# EAGLE design merkur-osdgruve-42-schield (EAGLE 6.6.0)
REVISION: 1.0
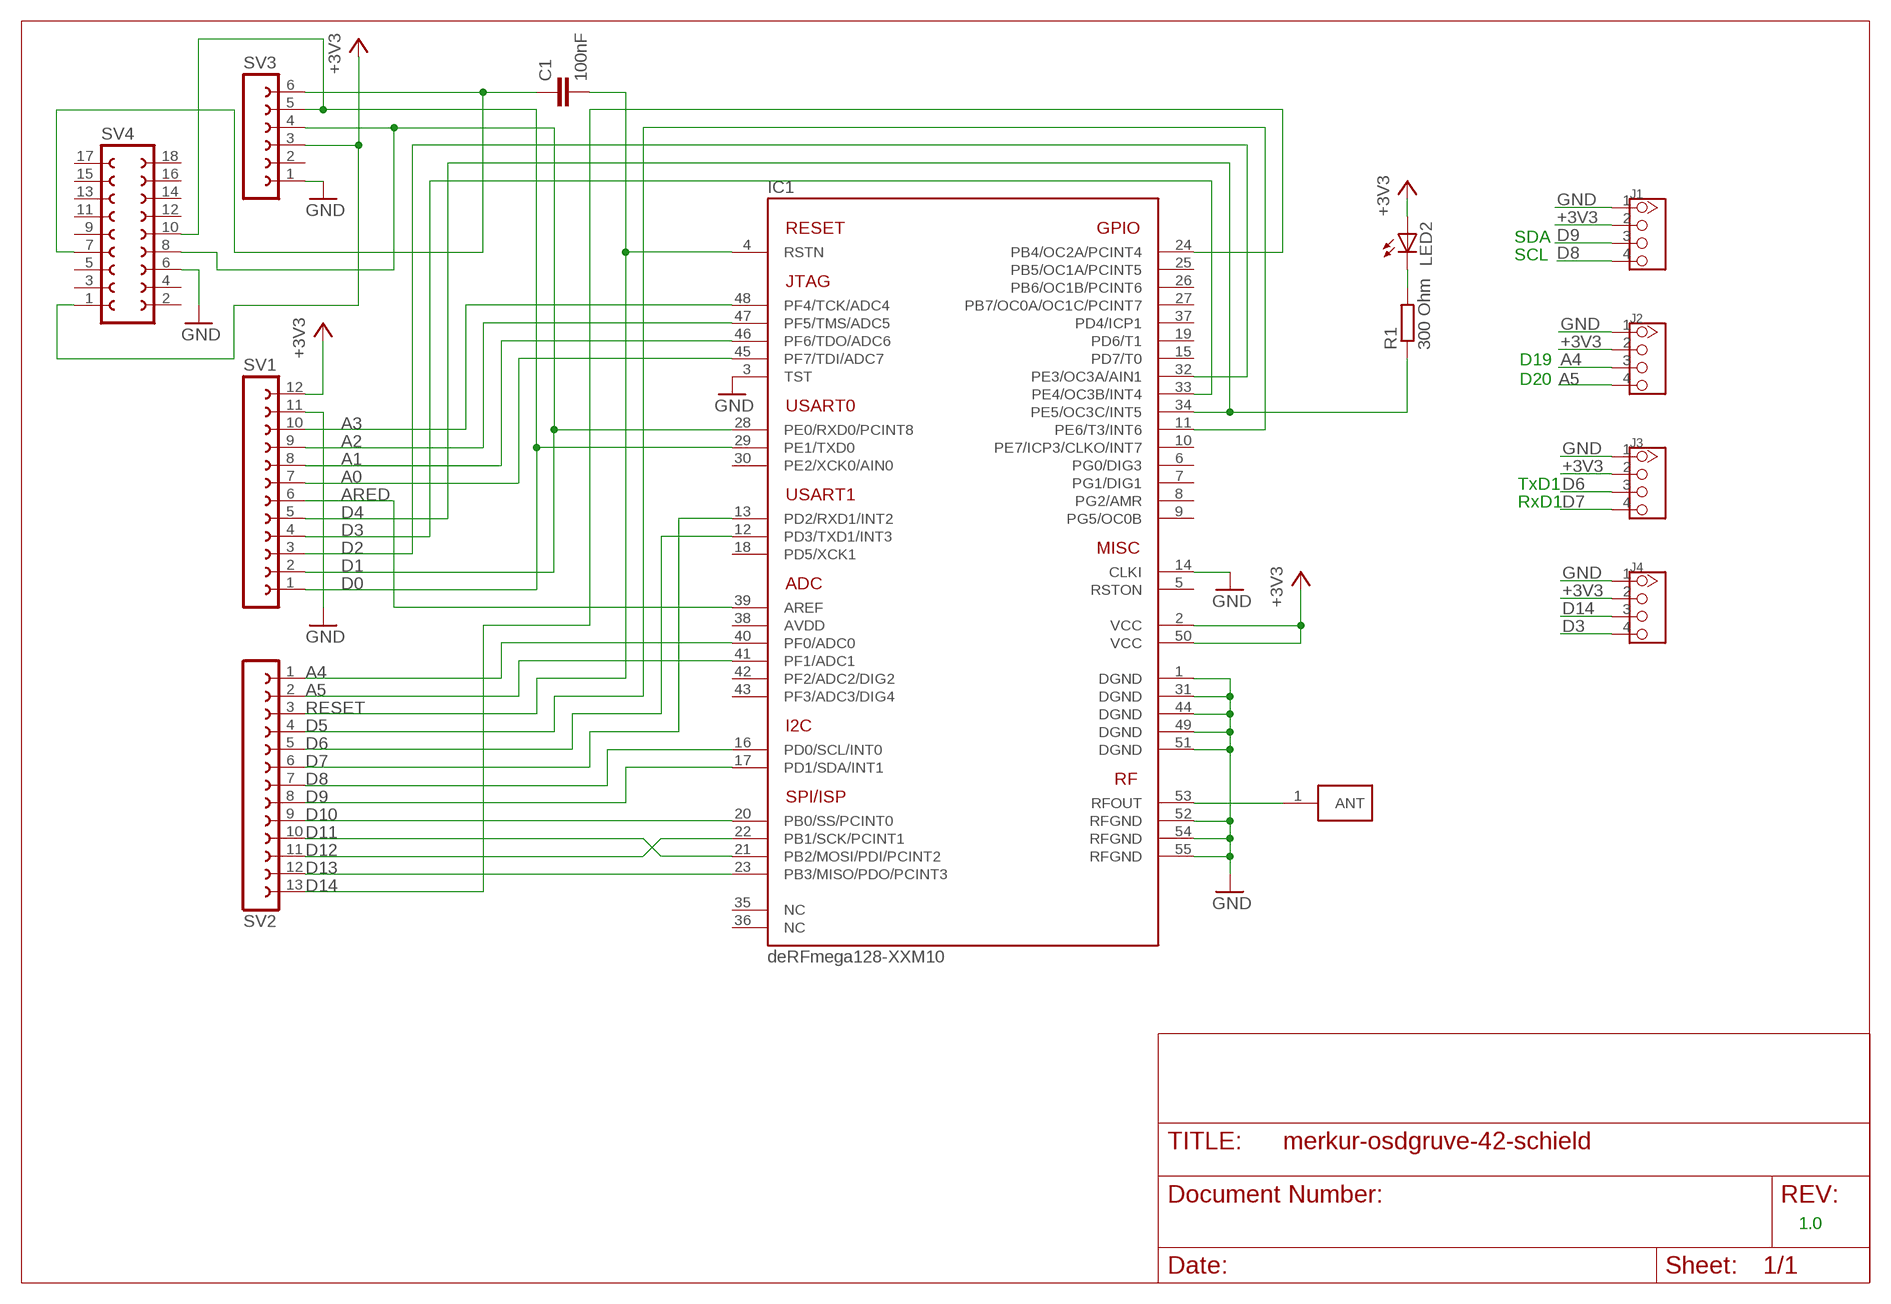
[diagram p0: schematic, sheet 1]

## Parts
C1  100nF  C-EUC0603  [C0603]
IC1  DERFMEGA128-XXM10  [A-M10]
J1  CONNECTOR_TWIG-4P-2.0-2.0  [CONNECTOR_4P-2.0]
J2  CONNECTOR_TWIG-4P-2.0-2.0  [CONNECTOR_4P-2.0]
J3  CONNECTOR_TWIG-4P-2.0-2.0  [CONNECTOR_4P-2.0]
J4  CONNECTOR_TWIG-4P-2.0-2.0  [CONNECTOR_4P-2.0]
LED2  LEDCHIP-LED0603  [CHIP-LED0603]
R1  300 Ohm  R-EU_R0603  [R0603]
SV1  FE12-1  [FE12]
SV2  FE13-1  [FE13]
SV3  FE06-1  [FE06]
SV4  FE09-2  [FE09-2]
U$1  PAD  [FE05-1]

## Nets
+3V3: IC1.2(VCC) IC1.50(VCC) J1.2 J2.2 J3.2 J4.2 LED2.A SV1.12 SV3.3 SV4.1
A0: IC1.45(PF7/TDI/ADC7) SV1.7
A1: IC1.46(PF6/TDO/ADC6) SV1.8
A2: IC1.47(PF5/TMS/ADC5) SV1.9
A3: IC1.48(PF4/TCK/ADC4) SV1.10
A4: IC1.40(PF0/ADC0) J2.3 SV2.1
A5: IC1.41(PF1/ADC1) J2.4 SV2.2
ARED: IC1.39(AREF) SV1.6
D0: IC1.29(PE1/TXD0) SV1.1 SV3.5 SV4.10
D1: IC1.28(PE0/RXD0/PCINT8) SV1.2 SV3.4 SV4.8
D2: IC1.32(PE3/OC3A/AIN1) SV1.3
D3: IC1.33(PE4/OC3B/INT4) J4.4 SV1.4
D4: IC1.34(PE5/OC3C/INT5) R1.1 SV1.5
D5: IC1.11(PE6/T3/INT6) SV2.4
D6: IC1.12(PD3/TXD1/INT3) J3.3 SV2.5
D7: IC1.13(PD2/RXD1/INT2) J3.4 SV2.6
D8: IC1.16(PD0/SCL/INT0) J1.4 SV2.7
D9: IC1.17(PD1/SDA/INT1) J1.3 SV2.8
D10: IC1.20(PB0/SS/PCINT0) SV2.9
D11: IC1.21(PB2/MOSI/PDI/PCINT2) SV2.10
D12: IC1.22(PB1/SCK/PCINT1) SV2.11
D13: IC1.23(PB3/MISO/PDO/PCINT3) SV2.12
D14: IC1.24(PB4/OC2A/PCINT4) J4.3 SV2.13
GND: IC1.1(DGND) IC1.3(TST) IC1.14(CLKI) IC1.31(DGND) IC1.44(DGND) IC1.49(DGND) IC1.51(DGND) IC1.52(RFGND) IC1.54(RFGND) IC1.55(RFGND) J1.1 J2.1 J3.1 J4.1 SV1.11 SV3.1 SV4.6
N$5: C1.1 SV3.6 SV4.7
N$23: LED2.C R1.2
RESET: C1.2 IC1.4(RSTN) SV2.3
RFOUT: IC1.53(RFOUT) U$1.1(ANT)
Unconnected: IC1.5(RSTON) IC1.6(PG0/DIG3) IC1.7(PG1/DIG1) IC1.8(PG2/AMR) IC1.9(PG5/OC0B) IC1.10(PE7/ICP3/CLKO/INT7) IC1.15(PD7/T0) IC1.18(PD5/XCK1) IC1.19(PD6/T1) IC1.25(PB5/OC1A/PCINT5) IC1.26(PB6/OC1B/PCINT6) IC1.27(PB7/OC0A/OC1C/PCINT7) IC1.30(PE2/XCK0/AIN0) IC1.35(NC) IC1.36(NC) IC1.37(PD4/ICP1) IC1.38(AVDD) IC1.42(PF2/ADC2/DIG2) IC1.43(PF3/ADC3/DIG4) SV3.2 SV4.2 SV4.3 SV4.4 SV4.5 SV4.9 SV4.11 SV4.12 SV4.13 SV4.14 SV4.15 SV4.16 SV4.17 SV4.18

## Notes on the sheet
- SDA
- SCL
- D19
- D20
- TxD1
- RxD1

## Library data of the parts
C1 = rcl:C-EU: CAPACITOR, European symbol
IC1 = deRFmodules:DERFMEGA128-XXM10: deRFmega128 IEEE 802.15.4 Low Power Wireless Radio Module Microcontroller: Atmel ATmega128RFA1 Transceiver: integrated Manufacturer: dresden elektronik ingenieurtechnik gmbh Website: http://www.dresden-elektronik.de
J1-J4 = Grove-Base Shield v1.3:CONNECTOR_TWIG-4P-2.0
LED2 = led:LED: LED OSRAM: - CHIPLED LG R971, LG N971, LY N971, LG Q971, LY Q971, LO R971, LY R971 LH N974, LH R974 LS Q976, LO Q976, LY Q976 LO Q996 - Hyper CHIPLED LW Q18S LB Q993, LB Q99A, LB R99A - SideLED LS A670, LO A670, LY A670, LG A670, LP A670 LB A673, LV A673, LT A673, LW A673 LH A674 LY A675 LS A676, LA A676, LO A676, LY A676, LW A676 LS A679, LY A679, LG A679 - Hyper Micro SIDELED® LS Y876, LA Y876, LO Y876, LY Y876 LT Y87S - SmartLED LW L88C, LW L88S LB L89C, LB L89S, LG L890 LS L89K, LO L89K, LY L89K LS L896, LA L896, LO L896, LY L896 - TOPLED LS T670, LO T670, LY T670, LG T670, LP T670 LSG T670, LSP T670, LSY T670, LOP T670, LYG T670 LG T671, LOG T671, LSG T671 LB T673, LV T673, LT T673, LW T673 LH T674 LS T676, LA T676, LO T676, LY T676, LB T676, LH T676, LSB T676, LW T676 LB T67C, LV T67C, LT T67C, LS T67K, LO T67K, LY T67K, LW E67C LS E67B, LA E67B, LO E67B, LY E67B, LB E67C, LV E67C, LT E67C LW T67C LS T679, LY T679, LG T679 LS T770, LO T770, LY T770, LG T770, LP T770 LB T773, LV T773, LT T773, LW T773 LH T774 LS E675, LA E675, LY E675, LS T675 LS T776, LA T776, LO T776, LY T776, LB T776 LHGB T686 LT T68C, LB T68C - Hyper Mini TOPLED® LB M676 - Mini TOPLED Santana® LG M470 LS M47K, LO M47K, LY M47K Source: http://www.osram.convergy.de LUXEON: - LUMILED® LXK2-PW12-R00, LXK2-PW12-S00, LXK2-PW14-U00, LXK2-PW14-V00 LXK2-PM12-R00, LXK2-PM12-S00, LXK2-PM14-U00 LXK2-PE12-Q00, LXK2-PE12-R00, LXK2-PE12-S00, LXK2-PE14-T00, LXK2-PE14-U00 LXK2-PB12-K00, LXK2-PB12-L00, LXK2-PB12-M00, LXK2-PB14-N00, LXK2-PB14-P00, LXK2-PB14-Q00 LXK2-PR12-L00, LXK2-PR12-M00, LXK2-PR14-Q00, LXK2-PR14-R00 LXK2-PD12-Q00, LXK2-PD12-R00, LXK2-PD12-S00 LXK2-PH12-R00, LXK2-PH12-S00 LXK2-PL12-P00, LXK2-PL12-Q00, LXK2-PL12-R00 Source: www.luxeon.com KINGBRIGHT: KA-3528ASYC Source: www.kingbright.com
R1 = rcl:R-EU_: RESISTOR, European symbol
SV1 = con-lsta:FE12-1: FEMALE HEADER; OC_FARNELL: unknown; OC_NEWARK: unknown
SV2 = con-lsta:FE13-1: FEMALE HEADER; OC_FARNELL: unknown; OC_NEWARK: unknown
SV3 = con-lsta:FE06-1: FEMALE HEADER; OC_FARNELL: unknown; OC_NEWARK: unknown
SV4 = con-lsta:FE09-2: FEMALE HEADER; OC_FARNELL: unknown; OC_NEWARK: unknown
U$1 = Pad:PAD

## Board
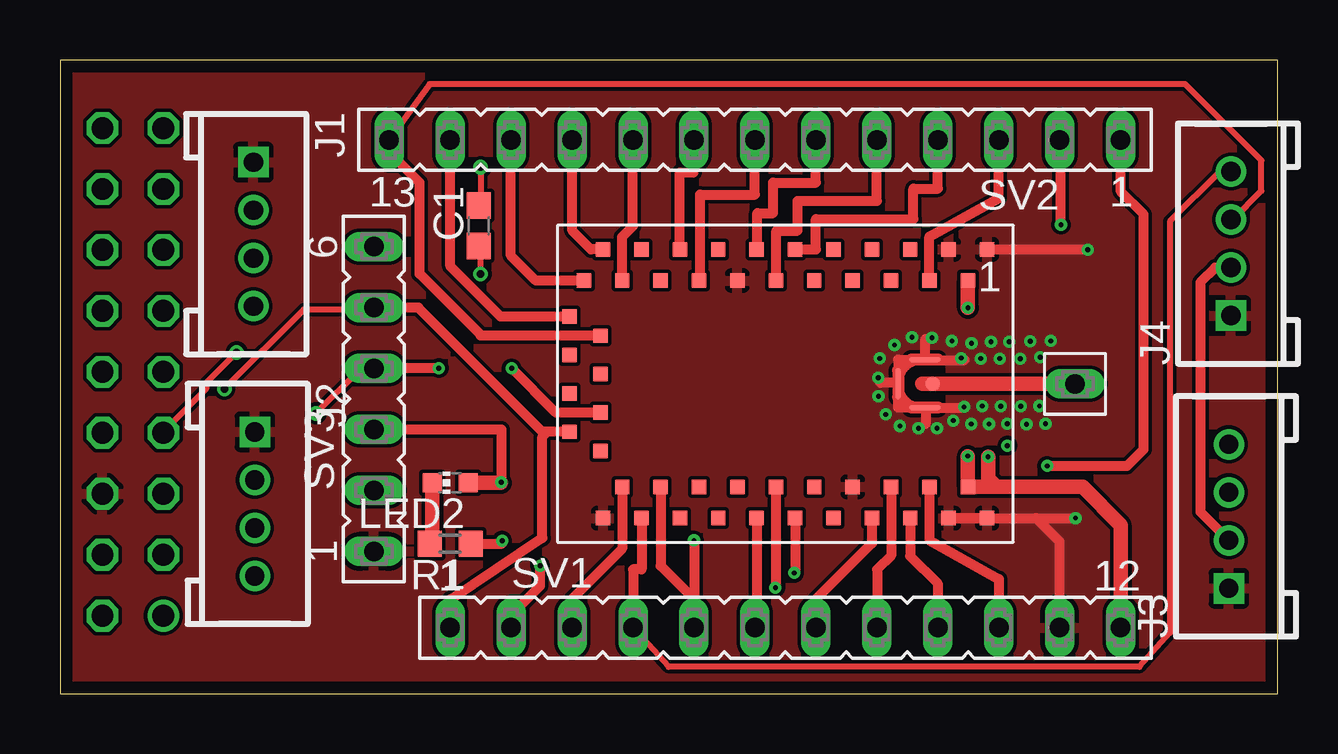
[diagram p1: board, top side]
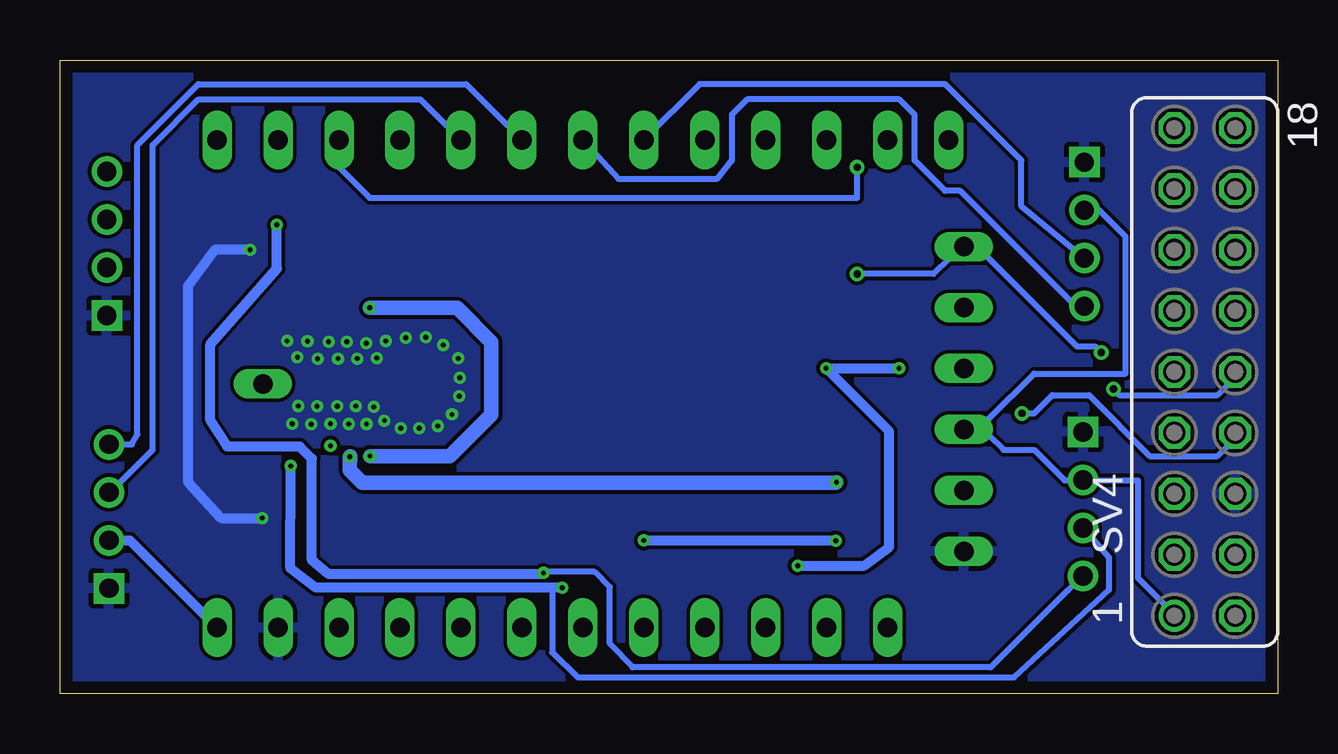
[diagram p2: board, bottom side, seen from below]

Size 50.74 x 26.41 mm. Coordinates in mm from the lower left corner, seen from the top.
Outline: 0,0 50.74,0 50.74,26.41 0,26.41 0,0
Copper layers (1*16): Top 0.035mm / dielectric 1.5mm / Bottom 0.035mm
Design rules "PCB-POOL *": minimum track width 10mil, minimum drill 12mil, track to track 6mil, track to pad 6mil, pad to pad 6mil, via to via 6mil, smd to smd 6mil, copper to edge 20mil, drill to drill 8mil, minimum pad ring 8mil, minimum via ring 6mil, stop-mask expansion 3mil, vias tented up to drill 0mil, thermal gap 8mil

### Footprints (pad centres in the part's own frame; a part is rotated, then mirrored left to right if it is on the bottom)
C0603 = smd 1.1 x 1: 1 -0.85,0; 2 0.85,0
A-M10 = smd 0.6 x 0.6: 1 -8.4,-5.6; 2 -7.6,-4.3; 3 -6.8,-5.6; 4 -6,-4.3; 5 -5.2,-5.6; 6 -4.4,-4.3; 7 -3.6,-5.6; 8 -2.8,-4.3; 9 -2,-5.6; 10 -1.2,-4.3; 11 -0.4,-5.6; 12 0.4,-4.3; 13 1.2,-5.6; 14 2,-4.3; 15 2.8,-5.6; 16 3.6,-4.3; 17 4.4,-5.6; 18 5.2,-4.3; 19 6,-5.6; 20 6.8,-4.3; 21 7.6,-5.6; 22 8.4,-4.3; 23 9,-2.8; 24 7.7,-2; 25 9,-1.2; 26 7.7,-0.4; 27 9,0.4; 28 7.7,1.2; 29 9,2; 30 7.7,2.8; 31 7.6,5.6; 32 6.8,4.3; 33 6,5.6; 34 5.2,4.3; 35 4.4,5.6; 36 3.6,4.3; 37 2.8,5.6; 38 2,4.3; 39 1.2,5.6; 40 0.4,4.3; 41 -0.4,5.6; 42 -1.2,4.3; 43 -2,5.6; 44 -2.8,4.3; 45 -3.6,5.6; 46 -4.4,4.3; 47 -5.2,5.6; 48 -6,4.3; 49 -6.8,5.6; 50 -7.6,4.3; 51 -8.4,5.6; 53 -6.14,0 | smd 1.3 x 0.2: 52 -5.8,1; 54 -5.8,-1 | smd 0.2 x 1.3: 55 -4.7,0
CONNECTOR_4P-2.0 = drill 0.8 pad 1.27 square: 1 -3,0 | drill 0.8 pad 1.27: 2 -1,0; 3 1,0; 4 3,0
CHIP-LED0603 = smd 0.8 x 0.8: A 0,-0.75; C 0,0.75
R0603 = smd 1 x 1.1: 1 -0.85,0; 2 0.85,0
FE12 = drill 0.813 long: 1 -13.97,0; 2 -11.43,0; 3 -8.89,0; 4 -6.35,0; 5 -3.81,0; 6 -1.27,0; 7 1.27,0; 8 3.81,0; 9 6.35,0; 10 8.89,0; 11 11.43,0; 12 13.97,0
FE13 = drill 0.813 long: 1 -15.24,0; 2 -12.7,0; 3 -10.16,0; 4 -7.62,0; 5 -5.08,0; 6 -2.54,0; 7 0,0; 8 2.54,0; 9 5.08,0; 10 7.62,0; 11 10.16,0; 12 12.7,0; 13 15.24,0
FE06 = drill 0.813 long: 1 -6.35,0; 2 -3.81,0; 3 -1.27,0; 4 1.27,0; 5 3.81,0; 6 6.35,0
FE09-2 = drill 0.914: 1 -10.16,1.27 | drill 0.914 octagon: 2 -10.16,-1.27; 3 -7.62,1.27; 4 -7.62,-1.27; 5 -5.08,1.27; 6 -5.08,-1.27; 7 -2.54,1.27; 8 -2.54,-1.27; 9 0,1.27; 10 0,-1.27; 11 2.54,1.27; 12 2.54,-1.27; 13 5.08,1.27; 14 5.08,-1.27; 15 7.62,1.27; 16 7.62,-1.27; 17 10.16,1.27; 18 10.16,-1.27
FE05-1 = drill 0.813 long: 1 -5.08,0

### Placement (x,y rotation side)
C1  17.46,19.5 90 top
IC1  30.23,12.92 180 top
J1  8.06,19.15 270 top
J2  8.12,7.91 270 top
J3  48.7,7.39 90 top
J4  48.79,18.76 90 top
LED2  16.26,8.79 90 top
R1  16.26,6.25 180 top
SV1  30.23,2.76 0 top
SV2  28.96,23.08 180 top
SV3  13.08,12.28 90 top
SV4  3.04,13.41 90 bottom
U$1  42.29,17.99 90 top

### Tracks (layer width: path | path; a pad name or v marks a point on that pad's centre or on a via)
+3V3  (via drill 0.2)
  Top 0.254: 37.84,9.74 v37.82,9.9
  Top 0.406: SV1.12 | 18.37,8.79 v18.39,8.81 18.39,11.01 SV3.3 | IC1.2 | J4.2 48.13,17.76 47.52,17.14 47.52,7.58 J3.2
  Top 0.61: 39.01,8.62 IC1.50 v37.82,9.9 | 39.01,8.62 42.61,8.62 44.2,7.03 SV1.12 | LED2.A 18.37,8.79 | v38.67,9.88 38.67,8.96 39.01,8.62 | v37.83,16.08 IC1.2
  Bottom 0.254: J1.2 7.61,20.32 6.34,19.05 6.34,13.34 10.15,13.34 12.06,11.43 12.69,11.43 SV3.3 12.69,10.79 12.06,10.79 11.42,10.16 10.15,10.16 8.88,8.89 8.25,8.89 J2.2 7.87,8.89 5.83,8.89 5.83,4.83 4.31,3.3 SV4.1
  Bottom 0.406: 38.65,9.89 v38.67,9.88 | J3.2 47.83,6.39 SV1.12
  Bottom 0.61: 38.65,9.89 38.65,9.74 | v18.39,8.81 18.41,8.79 38.14,8.79 38.66,9.31 38.66,9.87 v38.67,9.88 | v37.82,9.9 34.49,9.9 32.77,11.62 32.77,14.65 34.2,16.08 v37.83,16.08
A0
  Top 0.406: IC1.45 33.82,6.27 31.46,3.91 31.46,2.79 SV1.7
A1
  Top 0.406: IC1.46 34.62,5.76 34.05,5.18 34.05,2.77 SV1.8
A2
  Top 0.406: IC1.47 35.42,5.74 36.57,4.59 SV1.9
A3
  Top 0.406: IC1.48 36.22,6.4 39.12,4.78 SV1.10
A4  (via drill 0.2)
  Top 0.406: IC1.40 29.82,4.43 v29.81,4.42 | v41.13,9.49 v41.14,9.5 44.46,9.5 45.15,10.19 45.15,19.97 44.2,20.92 SV2.1
  Bottom 0.254: 30.24,4.42 30.24,1.72 29.16,0.68 10.99,0.68 7.03,4.33 7.03,5.67 J2.3
  Bottom 0.406: v41.13,9.49 41.13,9.31 41.14,5.23 40.08,4.42 30.24,4.42 v29.81,4.42
A5  (via drill 0.2)
  Top 0.406: IC1.41 30.62,5.02 v30.59,5.04 | v41.71,19.54 41.71,23.03 SV2.2
  Bottom 0.254: J2.4 8.75,4.3 11.96,1.09 26.88,1.09 27.83,2.08 27.83,4.45 28.46,5.08 30.55,5.08
  Bottom 0.406: v41.71,19.54 41.71,17.71 44.47,14.57 44.47,11.39 43.77,10.31 43.72,10.31 43.7,10.29 40.75,10.29 40.25,9.79 40.25,5.56 39.58,5.01 30.66,5.01 v30.59,5.04 30.55,5.08
ARED
  Top 0.406: IC1.39 29.03,2.83 SV1.6
D0  (via drill 0.3)
  Top 0.254: v6.85,12.7 10.15,16 12.95,16 SV3.5
  Top 0.406: IC1.29 20.3,10.92 | 20.3,10.92 20.1,10.92 14.93,16.09 14.1,16.09 SV3.5 | SV1.1 16.26,3.92 20.1,6.49 20.1,10.71 20.3,10.92
  Bottom 0.254: v6.85,12.7 6.6,12.45 2.53,12.45 1.77,13.21 SV4.10
D1  (via drill 0.2, 0.3)
  Top 0.254: v10.66,11.68 12.44,13.46 12.95,13.46 SV3.4
  Top 0.406: IC1.28 20.67,11.72 v18.82,13.56 | v15.78,13.57 14.62,13.57 SV3.4 | SV1.2 18.8,3.29 20,4.5 v20,5.34
  Bottom 0.254: v10.66,11.68 10.15,11.68 9.39,12.45 7.87,12.45 5.33,9.91 2.53,9.91 1.77,10.67 SV4.8
  Bottom 0.406: 18.8,13.54 v18.82,13.56 | v18.82,13.56 v15.79,13.56 v15.78,13.57 | v20,5.34 17.22,5.34 16.19,6.11 16.19,10.93 v18.82,13.56
D2
  Top 0.406: IC1.32 23.43,6.05 21.34,3.97 21.34,2.77 SV1.3
D3
  Top 0.254: J4.4 48.32,21.76 46.24,19.68 46.24,2.54 44.97,1.12 25.36,1.12 SV1.4
  Top 0.406: IC1.33 24.23,5.19 23.88,5.19 SV1.4
D4  (via drill 0.2)
  Top 0.406: IC1.34 25.03,5.33 26.42,3.94 26.42,3.81 | 26.42,3.81 SV1.5 | R1.1 18.42,6.25 v18.42,6.38 | v26.42,6.39 26.42,3.9 26.42,3.81
  Bottom 0.406: v18.42,6.38 26.45,6.38 v26.42,6.39
D5
  Top 0.406: IC1.11 31.5,18.52 31.5,19.78 35.56,19.78 35.56,21.05 36.57,21.05 SV2.4
D6
  Top 0.406: IC1.12 29.84,17.22 29.84,19.29 30.73,19.29 30.73,20.54 34.03,20.54 SV2.5
  Bottom 0.152: J3.3 48.65,8.39
  Bottom 0.254: 48.65,8.39 46.88,10.16 46.88,22.86 44.97,24.77 35.72,24.77 SV2.5
D7
  Top 0.406: IC1.13 29.06,18.52 29.06,20.03 29.72,20.03 29.72,21.3 31.5,21.3 SV2.6
  Bottom 0.254: J3.4 47.74,10.39 47.52,10.79 47.52,22.86 44.97,25.4 33.82,25.4 SV2.6
D8
  Top 0.406: IC1.16 26.67,17.22 26.67,20.79 28.96,20.79 SV2.7
  Bottom 0.254: J1.4 8.42,16.15 13.23,20.95 13.86,20.95 15.13,22.23 15.13,24.13 15.77,24.77 22.12,24.77 22.75,24.13 22.75,22.23 23.39,21.44 27.47,21.44 SV2.7
D9
  Top 0.406: IC1.17 25.82,21.72 26.4,21.71 26.4,23.06 SV2.8
  Bottom 0.152: J1.3
  Bottom 0.254: J1.3 10.69,20.32 10.69,22.23 13.86,25.4 24.09,25.4 SV2.8
D10
  Top 0.406: IC1.20 23.43,19.04 23.87,19.48 23.87,23.07 SV2.9
D11
  Top 0.406: IC1.21 22.12,18.52 21.34,19.3 21.34,23.07 SV2.10
D12
  Top 0.406: IC1.22 19.83,17.22 18.79,18.26 SV2.11
D13
  Top 0.406: IC1.23 18.36,15.72 16.27,17.81 16.27,23.06 SV2.12
D14
  Top 0.152: J4.3 48.86,19.76
  Top 0.254: 48.86,19.76 50.05,20.95 50.05,22.23 46.88,25.4 15.4,25.4 SV2.13
  Top 0.406: IC1.24 17.53,14.92 17.53,14.95 14.99,17.49 14.99,21.3 13.72,22.57 SV2.13
GND  (via drill 0.2)
  Top 0.406: SV1.11 41.64,6.34 40.67,7.32 IC1.51 IC1.49 42.23,7.32 v42.31,7.32 | v42.82,18.5 38.64,18.5 IC1.1 | v37.67,11.95 37.52,11.92 IC1.52 34.92,11.92 IC1.55 34.92,13.92 IC1.54 | 36.07,11.9 36.07,11.24 | 34.91,12.96 34.19,12.96 | 37.63,13.93 | 36.06,13.91 36.06,14.77 | 35.82,13.9 37.68,13.9
  Bottom 0.406: v42.31,7.32 44.02,7.32 45.41,8.84 45.41,16.99 44.28,18.5 v42.82,18.5
  other vias: 37.98,14.61 38.79,14.66 39.55,14.67 37.55,13.99 38.36,13.96 39.16,13.96 40.85,14.02 40.01,13.96 40.43,14.69 38.42,11.99 39.2,11.98 38.71,11.24 39.47,11.25 40.03,11.98 40.27,11.23 40.81,11.99 37.16,14.7 36.33,14.84 35.5,14.85 34.77,14.53 34.15,13.97 34.09,13.17 34.11,12.4 34.41,11.64 35,11.15 35.77,11.06 36.54,11.06 37.22,11.38 37.97,11.24 41.28,14.7 41.06,11.25
  pour Bottom: -0.97,27.3 51.96,27.3 51.96,-1.27 -0.97,-1.27
  pour Top: -1.28,27.3 51.96,27.3 51.96,-1.27 -1.28,-1.27
N$5  (via drill 0.3)
  Top 0.152: 17.53,18.12 C1.1
  Top 0.254: v17.53,17.49 17.53,18.12 | v7.36,14.22 6.09,12.95 6.09,12.7 4.31,10.92 SV4.7
  Bottom 0.254: v17.53,17.49 14.35,17.49 13.72,18.12 13.08,18.12 SV3.6 12.95,18.54 12.44,18.54 8.37,14.48 7.61,14.48 v7.36,14.22
N$23
  Top 0.61: LED2.C 15.51,6.35 R1.2
N$26  (via drill 0.2)
  other vias: 39.47,10.34
RESET  (via drill 0.3)
  Top 0.254: v17.53,21.93 17.53,20.66 C1.2
  Top 0.406: IC1.4 36.22,19.04 39.1,20.65 39.1,23.07 SV2.3
  Bottom 0.254: v17.53,21.93 17.53,20.66 37.84,20.66 39.11,21.93 SV2.3
RFOUT
  Top 0.61: IC1.53 U$1.1

### Text on the board
bLabel: http://www.coxcoon.at